# Altium project PCB_Project.PrjPcb
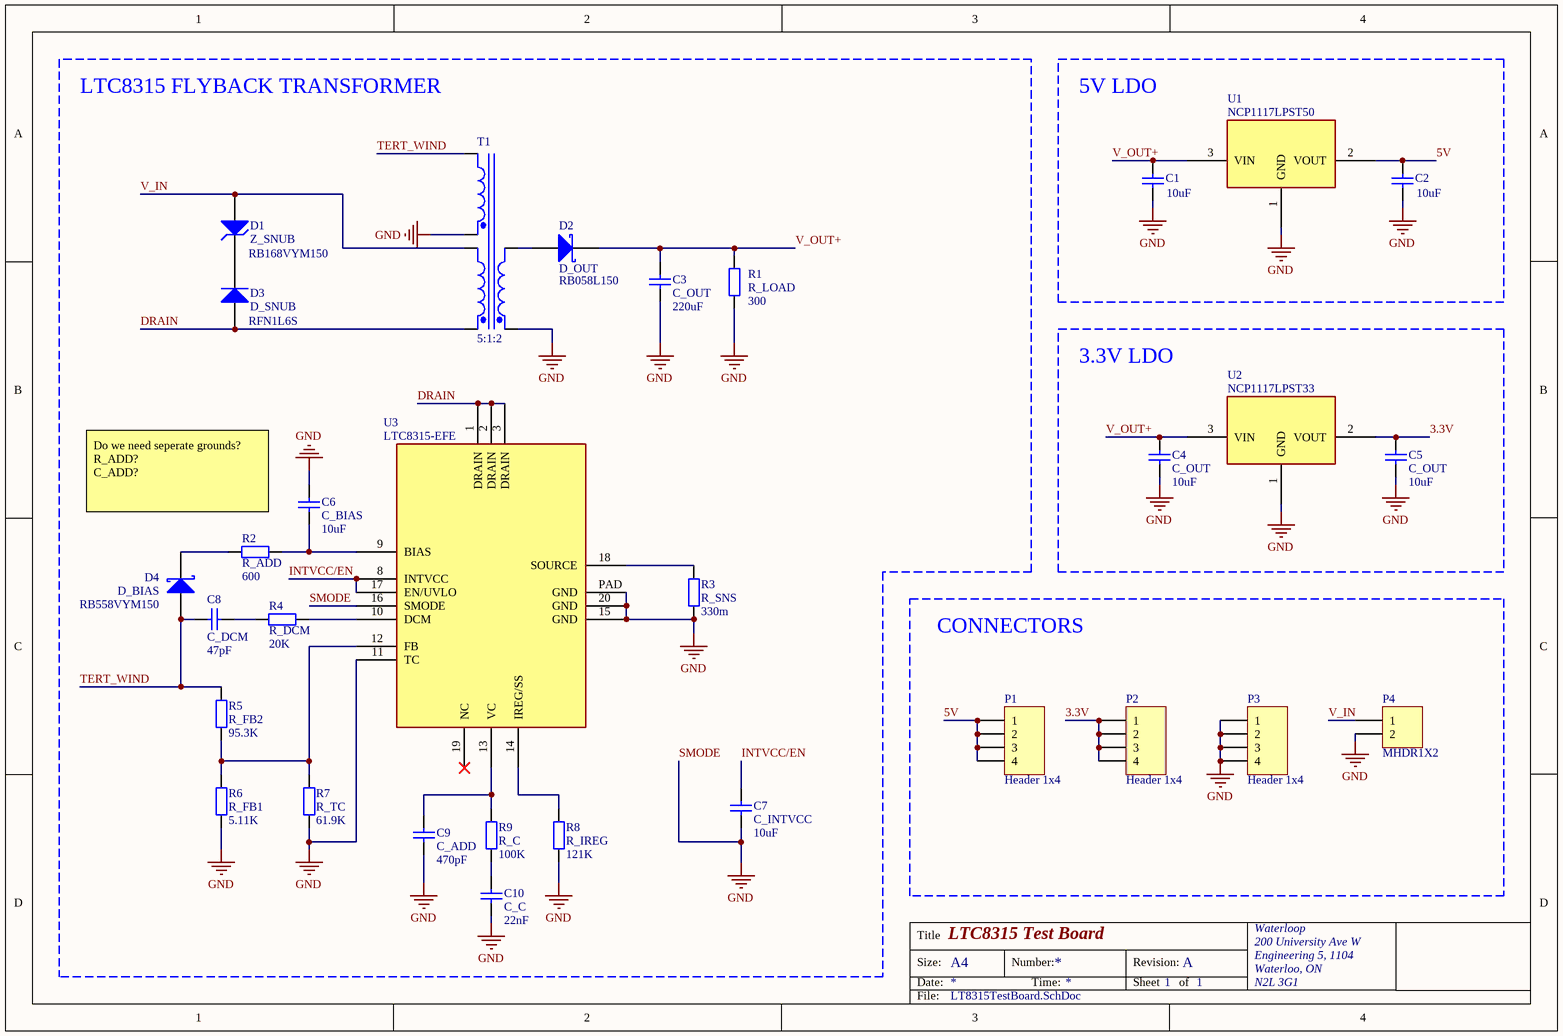
[diagram p0: LT8315TestBoard.SchDoc]
1 sheet, 31 parts. Net scope: global (net labels, ports and power ports of the same name join across sheets).

## Sheet LT8315TestBoard.SchDoc: LTC8315 Test Board
size A4; Organization: Waterloop; Address1: 200 University Ave W; Address2: Engineering 5, 1104; Address3: Waterloo, ON; Address4: N2L 3G1; Revision: A; SheetNumber: 1; SheetTotal: 1

### Parts
C1  value 10uF  [RAD-0.3]  (hidden comment: C_OUT)
C2  value 10uF  [RAD-0.3]  (hidden comment: C_OUT)
C3  C_OUT  value 220uF  [RAD-0.3]
C4  C_OUT  value 10uF  [RAD-0.3]
C5  C_OUT  value 10uF  [RAD-0.3]
C6  C_BIAS  value 10uF  [RAD-0.3]
C7  C_INTVCC  value 10uF  [RAD-0.3]
C8  C_DCM  value 47pF  [RAD-0.3]
C9  C_ADD  value 470pF  [RAD-0.3]
C10  C_C  value 22nF  [RAD-0.3]
D1  Z_SNUB  PartNumber: RB168VYM150  [DIODE-0.7]
D2  D_OUT  PartNumber: RB058L150  [SMB]
D3  D_SNUB  PartNumber: RFN1L6S  [SMC]
D4  D_BIAS  PartNumber: RB558VYM150  [SMB]
P1  Header 1x4  [HDR1X4]
P2  Header 1x4  [HDR1X4]
P3  Header 1x4  [HDR1X4]
P4  MHDR1X2  [MHDR1X2]
R1  R_LOAD  value 300  [AXIAL-0.4]
R2  R_ADD  value 600  [AXIAL-0.4]
R3  R_SNS  value 330m  [AXIAL-0.4]
R4  R_DCM  value 20K  [AXIAL-0.4]
R5  R_FB2  value 95.3K  [AXIAL-0.4]
R6  R_FB1  value 5.11K  [AXIAL-0.4]
R7  R_TC  value 61.9K  [AXIAL-0.4]
R8  R_IREG  value 121K  [AXIAL-0.4]
R9  R_C  value 100K  [AXIAL-0.4]
T1  5:1:2  [TRF_6]
U1  NCP1117LPST50
U2  NCP1117LPST33
U3  LTC8315-EFE

### Blocks framed on the sheet
LTC8315 FLYBACK TRANSFORMER: C3 C6-C10 D1-D4 R1-R9 T1 U3
5V LDO: C1 C2 U1
3.3V LDO: C4 C5 U2
CONNECTORS: P1-P4

### Nets
SMODE: C1.1 C2.1 C3.1 C4.1 C5.1 C6.1 C7.2 C9.1 C10.1 P3.1 P3.2 P3.3 P3.4 P4.2 R1.1 R3.1 R6.1 R7.1 R8.1 T1.1(Pri+) T1.5(Sec2+) U1.1(GND) U2.1(GND) U3.11(TC) U3.15(GND) U3.16(SMODE) U3.20(GND) U3.PAD(GND)  [also labelled GND]
3.3V: C5.2 P2.1 P2.2 P2.3 P2.4 U2.2(VOUT)
5V: C2.2 P1.1 P1.2 P1.3 P1.4 U1.2(VOUT)
DRAIN: D3.1(A) T1.3(Sec1+) U3.1(DRAIN) U3.2(DRAIN) U3.3(DRAIN)
INTVCC/EN: C7.1 U3.8(INTVCC) U3.17(EN/UVLO)
TERT_WIND: C8.1 D4.1(A) R5.2 T1.6(Sec2-)
V_IN: D1.1(A) P4.1 T1.4(Sec1-)
V_OUT+: C1.2 C3.2 C4.2 D2.2(K) R1.2 U1.3(VIN) U2.3(VIN)
NetC6_2: C6.2 R2.1 U3.9(BIAS)
NetC8_2: C8.2 R4.2
NetC9_2: C9.2 R9.2 U3.13(VC)
NetC10_2: C10.2 R9.1
NetD1_2: D1.2(K) D3.2(K)
NetD2_1: D2.1(A) T1.2(Pri-)
NetD4_2: D4.2(K) R2.2
NetR3_2: R3.2 U3.18(SOURCE)
NetR4_1: R4.1 U3.10(DCM)
NetR5_1: R5.1 R6.2 R7.2 U3.12(FB)
NetR8_2: R8.2 U3.14(IREG/SS)

Not connected (* = marked no-connect by the designer): U3 19(NC)*

### Notes on the sheet
- Do we need seperate grounds?
  R_ADD?
  C_ADD?
- Title
- Size:
- Date:
- A4
- Number:
- Time:
- Revision:
- Sheet
- of
- File:

### Library data of the parts
C1-C10 = Cap: Capacitor; Published: 8-Jun-2000; LatestRevisionDate: 17-Jul-2002; LatestRevisionNote: Re-released for DXP Platform.; PackageReference: RAD-0.3; Publisher: Altium Limited; PackageDescription: Radial Cap, Thru-Hole; 2 Leads; 0.3 in Pin Spacing
D1 = D Zener: Zener Diode; Published: 8-Jun-2000; LatestRevisionDate: 17-Jul-2002; LatestRevisionNote: Re-released for DXP Platform.; PackageReference: DIODE-0.7; Publisher: Altium Limited; PackageDescription: Diode, Thru-Hole; 2 Leads; 0.7 in Pin Spacing
D2 D4 = D Schottky: Schottky Diode; Published: 8-Jun-2000; LatestRevisionDate: 17-Jul-2002; LatestRevisionNote: Re-released for DXP Platform.; PackageReference: SMB; Publisher: Altium Limited; PackageDescription: DO-214-AA/SMB; 2 C-Bend Leads; Body 5.3 x 3.6 mm, inc. leads (LxW); Code_JEDEC: DO-214-AA
D3 = Diode: Default Diode; Published: 8-Jun-2000; LatestRevisionDate: 17-Jul-2002; LatestRevisionNote: Re-released for DXP Platform.; PackageVersion: Sep-1996; PackageReference: SMC; Publisher: Altium Limited; PackageDescription: DO-214-AB/SMC; 2 C-Bend Leads; Body 7.9 x 5.9 mm, inc. leads (LxW); Code_JEDEC: DO-214-AB
P1-P3 = Header 4: Header, 4-Pin; LatestRevisionDate: 17-Jul-2002; LatestRevisionNote: Re-released for DXP Platform.; Publisher: Altium Limited
P4 = MHDR1X2: Header, 2-Pin; LatestRevisionDate: 17-Jul-2002; LatestRevisionNote: Re-released for DXP Platform.; Publisher: Altium Limited
R1-R9 = Res2: Resistor; Published: 8-Jun-2000; LatestRevisionDate: 17-Jul-2002; LatestRevisionNote: Re-released for DXP Platform.; PackageReference: AXIAL-0.4; Publisher: Altium Limited; PackageDescription: Axial Device, Thru-Hole; 2 Leads; 0.4 in Pin Spacing
T1 = Trans3: Three-winding Transformer (Non-Ideal); Sim Note: Enter the turns ratios, Core loss resistance, Magnetising Reactance, Leakage Reactances and Resistances referred to the primary side into the parameter fields.; Published: 25-Jan-2001; LatestRevisionDate: 17-Jul-2002; LatestRevisionNote: Re-released for DXP Platform.; PackageReference: TRF_6; Publisher: Altium Limited; PackageDescription: Transformer; 6 Leads